# EAGLE schematic HSI-interface-2 (EAGLE 7.6.0)

## Sheet 1 of 7
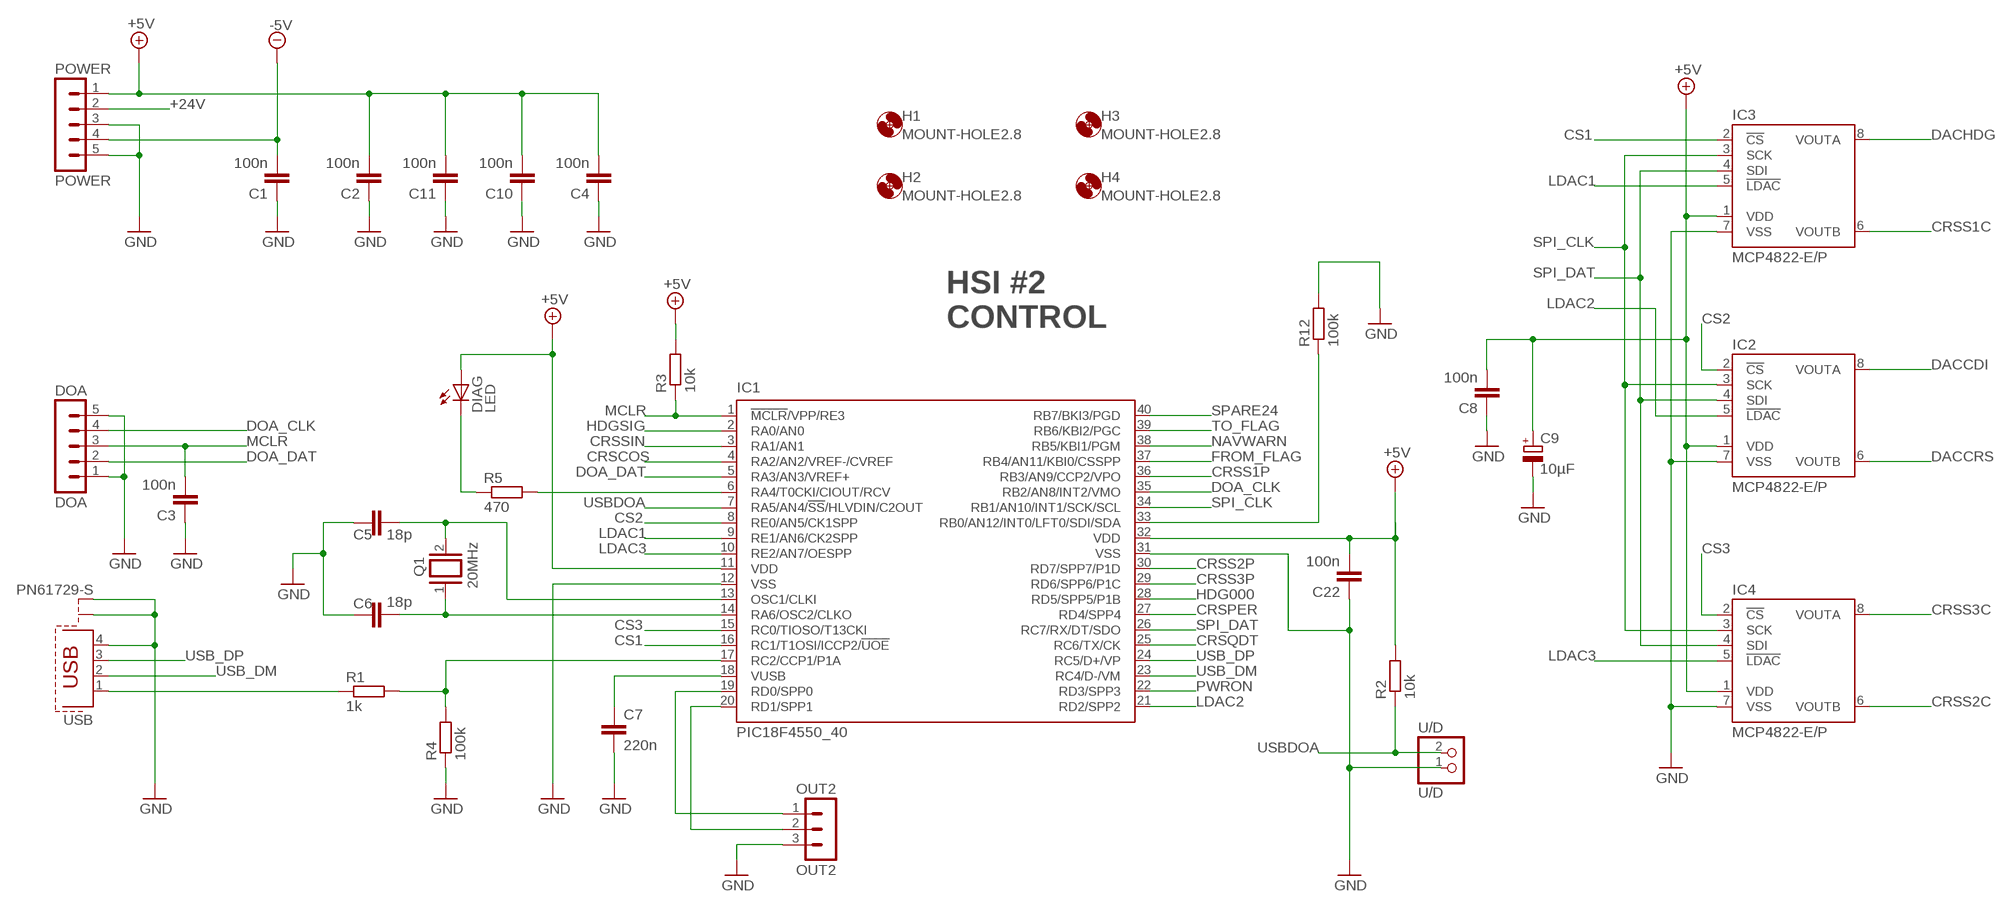
[diagram p0: schematic, sheet 1]

### Parts
C1  100n  C-EU025-025X050  [C025-025X050]
C2  100n  C-EU025-025X050  [C025-025X050]
C3  100n  C-EU025-025X050  [C025-025X050]
C4  100n  C-EU025-025X050  [C025-025X050]
C5  18p  C-EU025-025X050  [C025-025X050]
C6  18p  C-EU025-025X050  [C025-025X050]
C7  220n  C5/3  [C5B3]
C8  100n  C-EU025-025X050  [C025-025X050]
C9  10µF  CPOL-EUE2.5-5  [E2,5-5]
C10  100n  C-EU025-025X050  [C025-025X050]
C11  100n  C-EU025-025X050  [C025-025X050]
C22  100n  C-EU025-025X050  [C025-025X050]
DIAG  LED  LED3MM  [LED3MM]
DOA  DOA  MA05-1  [MA05-1]
H1  MOUNT-HOLE2.8  [2,8]
H2  MOUNT-HOLE2.8  [2,8]
H3  MOUNT-HOLE2.8  [2,8]
H4  MOUNT-HOLE2.8  [2,8]
IC1  PIC18F4550_40  [DIL40]
IC2  MCP4822-E/P  [DIL08]
IC3  MCP4822-E/P  [DIL08]
IC4  MCP4822-E/P  [DIL08]
OUT2  OUT2  MA03-1  [MA03-1]
POWER  POWER  MA05-1  [MA05-1]
Q1  20MHz  XTAL/S  [QS]
R1  1k  R-EU_0204/7  [0204/7]
R2  10k  R-EU_0204/7  [0204/7]
R3  10k  R-EU_0204/7  [0204/7]
R4  100k  R-EU_0204/7  [0204/7]
R5  470  R-EU_0204/7  [0204/7]
R12  100k  R-EU_0204/7  [0204/7]
U/D  U/D  PINHD-1X2  [1X02]
USB  PN61729-S  [PN61729-S]

### Nets
+5V [+5V]: C2.2 C4.2 C8.2 C9.+ C10.2 C11.2 C22.2 DIAG.A IC1.11(VDD) IC1.32(VDD) IC2.1(VDD) IC3.1(VDD) IC4.1(VDD) POWER.1 R2.2 R3.2 ; also sheet 2,3,4,5,6,7
+24V: POWER.2 ; also sheet 3
-5V [-5V]: C1.2 POWER.4 ; also sheet 2,4,5,6,7
CRSCOS: IC1.4(RA2/AN2/VREF-/CVREF) ; also sheet 6
CRSPER: IC1.27(RD4/SPP4) ; also sheet 2
CRSQDT: IC1.25(RC6/TX/CK) ; also sheet 2
CRSS1C: IC3.6(VOUTB) ; also sheet 7
CRSS1P: IC1.36(RB3/AN9/CCP2/VPO) ; also sheet 7
CRSS2C: IC4.6(VOUTB) ; also sheet 7
CRSS2P: IC1.30(RD7/SPP7/P1D) ; also sheet 7
CRSS3C: IC4.8(VOUTA) ; also sheet 7
CRSS3P: IC1.29(RD6/SPP6/P1C) ; also sheet 7
CRSSIN: IC1.3(RA1/AN1) ; also sheet 5
CS1: IC1.16(RC1/T1OSI/ICCP2/!UOE) IC3.2(!CS)
CS2: IC1.8(RE0/AN5/CK1SPP) IC2.2(!CS)
CS3: IC1.15(RC0/TIOSO/T13CKI) IC4.2(!CS)
DACCDI: IC2.8(VOUTA) ; also sheet 3
DACCRS: IC2.6(VOUTB) ; also sheet 3
DACHDG: IC3.8(VOUTA) ; also sheet 3
DOA_CLK: DOA.4 IC1.35(RB2/AN8/INT2/VMO)
DOA_DAT: DOA.2 IC1.5(RA3/AN3/VREF+)
FROM_FLAG: IC1.37(RB4/AN11/KBI0/CSSPP) ; also sheet 3
GND [ground]: C1.1 C2.1 C3.1 C4.1 C5.1 C6.1 C7.2 C8.1 C9.- C10.1 C11.1 C22.1 DOA.1 DOA.5 IC1.12(VSS) IC1.31(VSS) IC2.7(VSS) IC3.7(VSS) IC4.7(VSS) OUT2.3 POWER.3 POWER.5 R4.1 R12.2 U/D.1 USB.4 USB.S1 USB.S2 ; also sheet 2,3,4,5,6,7
HDG000: IC1.28(RD5/SPP5/P1B) ; also sheet 2
HDGSIG: IC1.2(RA0/AN0) ; also sheet 4
LDAC1: IC1.9(RE1/AN6/CK2SPP) IC3.5(!LDAC)
LDAC2: IC1.21(RD2/SPP2) IC2.5(!LDAC)
LDAC3: IC1.10(RE2/AN7/OESPP) IC4.5(!LDAC)
MCLR: C3.2 DOA.3 IC1.1(!MCLR!/VPP/RE3) R3.1
N$1: IC1.20(RD1/SPP1) OUT2.2
N$2: IC1.19(RD0/SPP0) OUT2.1
N$22: DIAG.K(C) R5.1
N$24: IC1.6(RA4/T0CKI/CIOUT/RCV) R5.2
N$58: R1.1 USB.1
N$60: IC1.17(RC2/CCP1/P1A) R1.2 R4.2
N$61: C6.2 IC1.14(RA6/OSC2/CLKO) Q1.1
N$84: C5.2 IC1.13(OSC1/CLKI) Q1.2
N$96: C7.1 IC1.18(VUSB)
N$122: IC1.33(RB0/AN12/INT0/LFT0/SDI/SDA) R12.1
NAVWARN: IC1.38(RB5/KBI1/PGM) ; also sheet 3
PWRON: IC1.22(RD3/SPP3) ; also sheet 2
SPARE24: IC1.40(RB7/BKI3/PGD) ; also sheet 3
SPI_CLK: IC1.34(RB1/AN10/INT1/SCK/SCL) IC2.3(SCK) IC3.3(SCK) IC4.3(SCK)
SPI_DAT: IC1.26(RC7/RX/DT/SDO) IC2.4(SDI) IC3.4(SDI) IC4.4(SDI)
TO_FLAG: IC1.39(RB6/KBI2/PGC) ; also sheet 3
USB_DM: IC1.23(RC4/D-/VM) USB.2
USB_DP: IC1.24(RC5/D+/VP) USB.3
USBDOA: IC1.7(RA5/AN4/!SS!/HLVDIN/C2OUT) R2.1 U/D.2

### Notes on the sheet
- HSI #2
  CONTROL

## Sheet 2 of 7
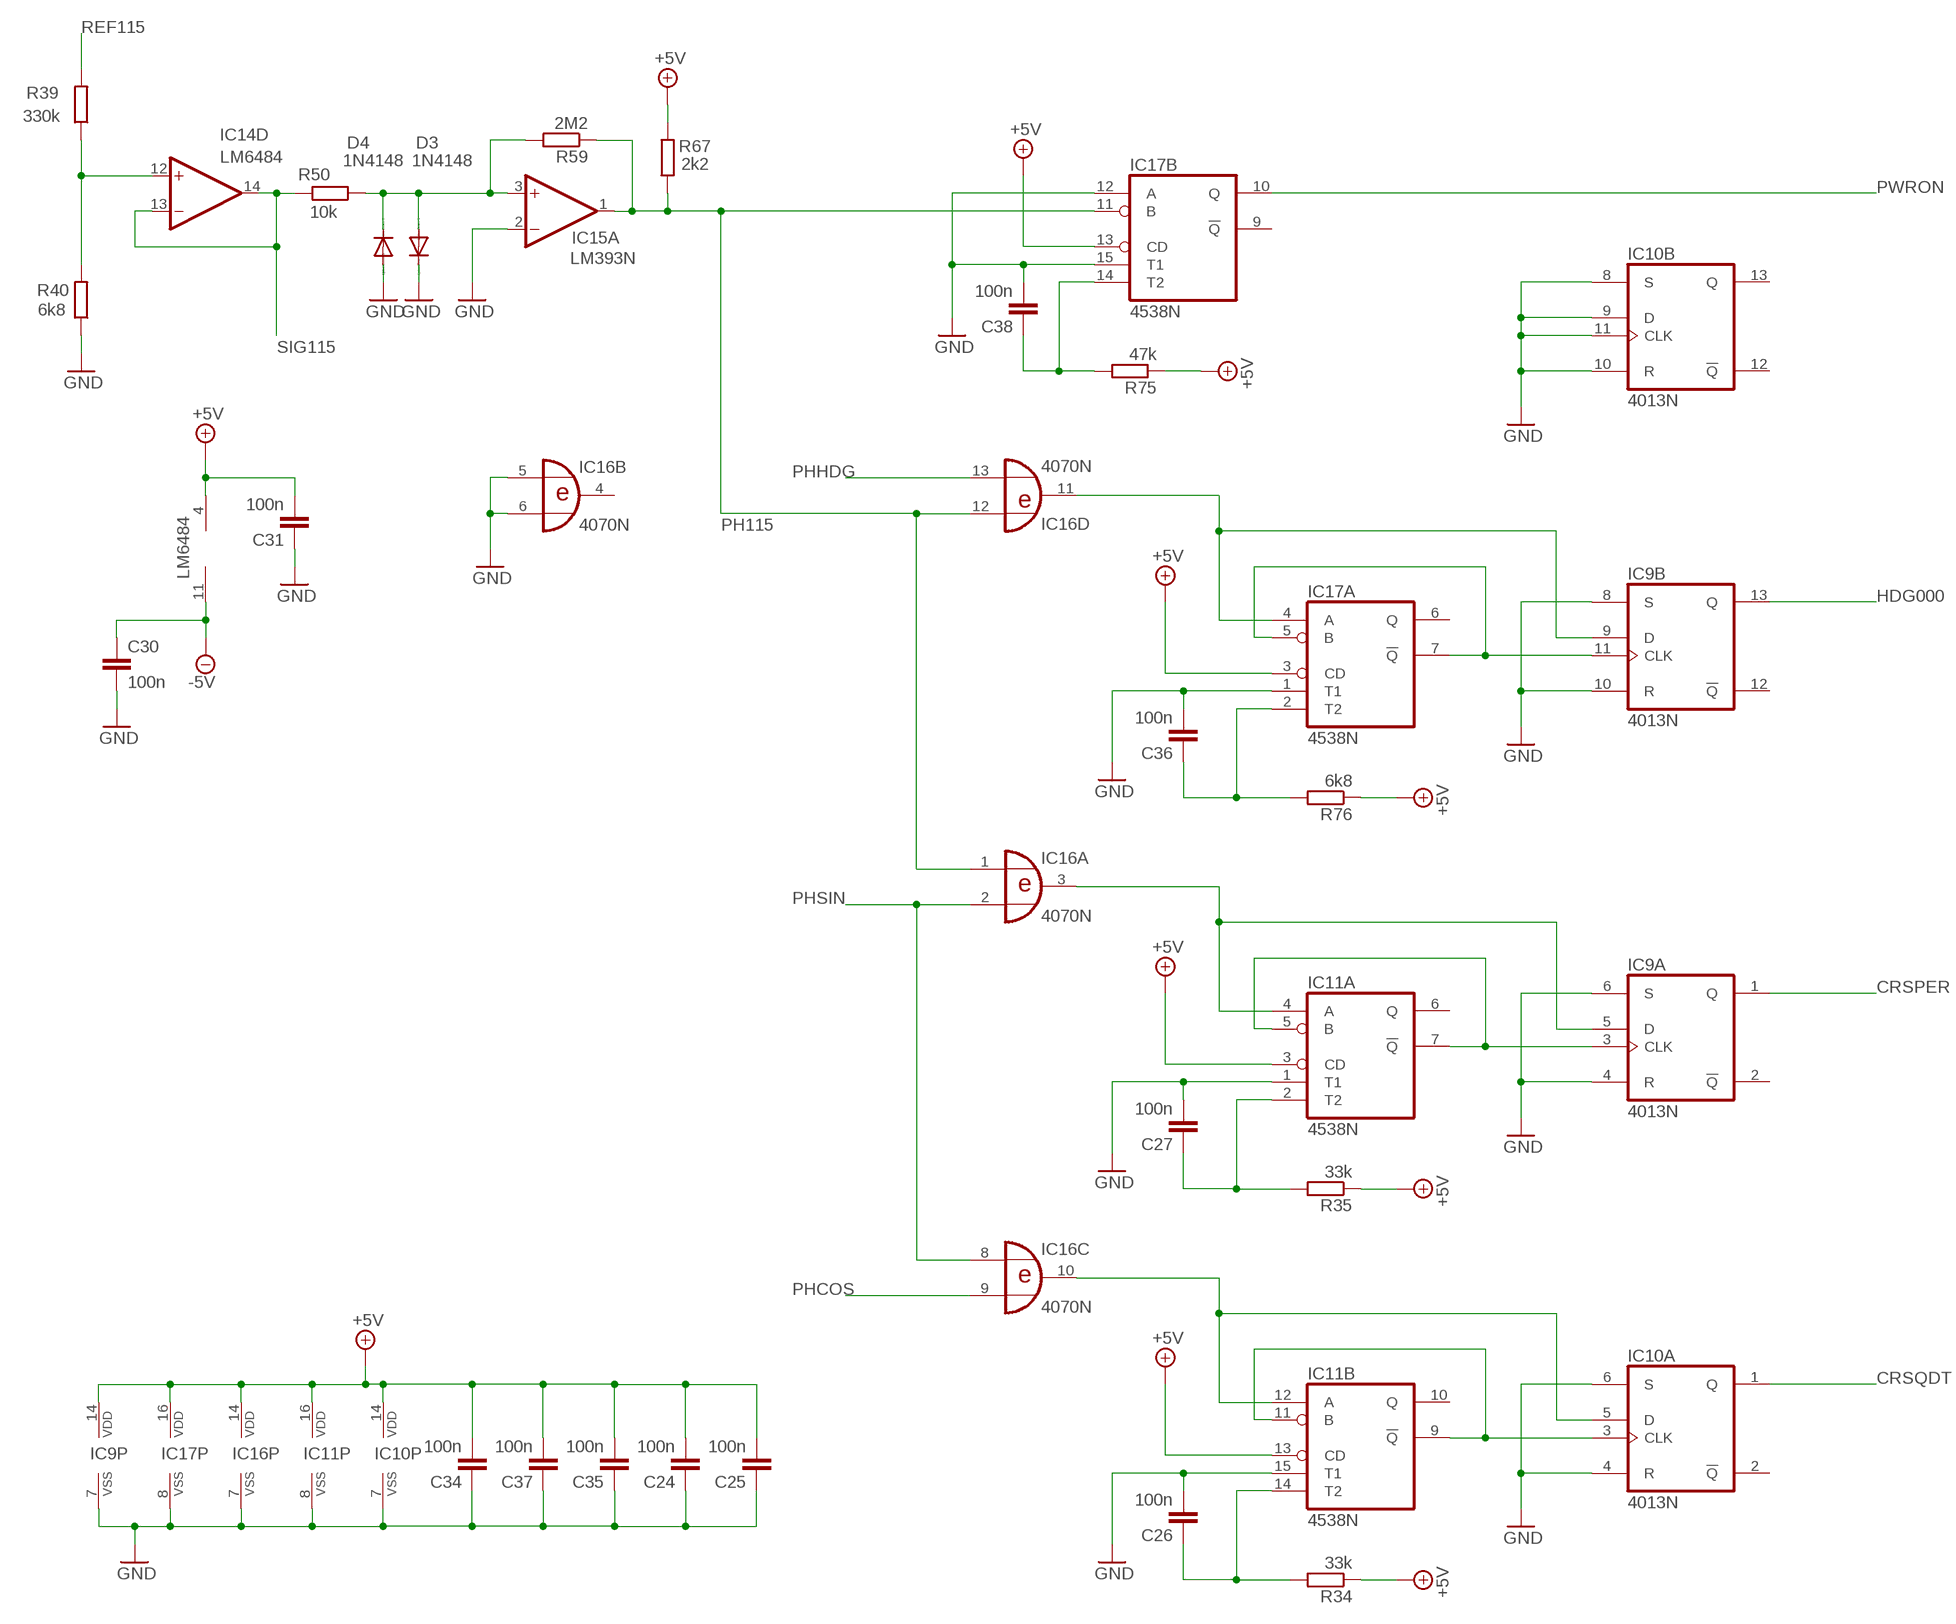
[diagram p1: schematic, sheet 2]

### Parts
C24  100n  C-EU025-025X050  [C025-025X050]
C25  100n  C-EU025-025X050  [C025-025X050]
C26  100n  C-EU025-025X050  [C025-025X050]
C27  100n  C-EU025-025X050  [C025-025X050]
C30  100n  C-EU025-025X050  [C025-025X050]
C31  100n  C-EU025-025X050  [C025-025X050]
C34  100n  C-EU025-025X050  [C025-025X050]
C35  100n  C-EU025-025X050  [C025-025X050]
C36  100n  C-EU025-025X050  [C025-025X050]
C37  100n  C-EU025-025X050  [C025-025X050]
C38  100n  C-EU025-025X050  [C025-025X050]
D3  1N4148  1N4148DO35-7  [DO35-7]
D4  1N4148  1N4148DO35-7  [DO35-7]
IC9  4013N  [DIL14]
IC10  4013N  [DIL14]
IC11  4538N  [DIL16]
IC14  LM6484  LM324N  [DIL14]
IC15  LM393N  [DIL08]
IC16  4070N  [DIL14]
IC17  4538N  [DIL16]
R34  33k  R-EU_0204/7  [0204/7]
R35  33k  R-EU_0204/7  [0204/7]
R39  330k  R-EU_0204/7  [0204/7]
R40  6k8  R-EU_0204/7  [0204/7]
R50  10k  R-EU_0204/7  [0204/7]
R59  2M2  R-EU_0204/7  [0204/7]
R67  2k2  R-EU_0204/7  [0204/7]
R75  47k  R-EU_0204/7  [0204/7]
R76  6k8  R-EU_0204/7  [0204/7]

### Nets
+5V [+5V]: C24.2 C25.2 C31.2 C34.2 C35.2 C37.2 IC9.14(P:VDD) IC10.14(P:VDD) IC11.3(A:CD) IC11.13(B:CD) IC11.16(P:VDD) IC14.4(P:V+) IC16.14(P:VDD) IC17.3(A:CD) IC17.13(B:CD) IC17.16(P:VDD) R34.1 R35.1 R67.2 R75.1 R76.1 ; also sheet 1,3,4,5,6,7
-5V [-5V]: C30.1 IC14.11(P:V-) ; also sheet 1,4,5,6,7
CRSPER: IC9.1(A:Q) ; also sheet 1
CRSQDT: IC10.1(A:Q) ; also sheet 1
GND [ground]: C24.1 C25.1 C26.2 C27.2 C30.2 C31.1 C34.1 C35.1 C36.2 C37.1 C38.2 D3.C D4.A IC9.4(A:R) IC9.6(A:S) IC9.7(P:VSS) IC9.8(B:S) IC9.10(B:R) IC10.4(A:R) IC10.6(A:S) IC10.7(P:VSS) IC10.8(B:S) IC10.9(B:D) IC10.10(B:R) IC10.11(B:CLK) IC11.1(A:T1) IC11.8(P:VSS) IC11.15(B:T1) IC15.2(A:-IN) IC16.5(B:I0) IC16.6(B:I1) IC16.7(P:VSS) IC17.1(A:T1) IC17.8(P:VSS) IC17.12(B:A) IC17.15(B:T1) R40.1 ; also sheet 1,3,4,5,6,7
HDG000: IC9.13(B:Q) ; also sheet 1
N$3: IC9.11(B:CLK) IC17.5(A:B) IC17.7(A:!Q)
N$7: IC14.12(D:+IN) R39.1 R40.2
N$29: IC9.9(B:D) IC16.11(D:O) IC17.4(A:A)
N$39: IC10.5(A:D) IC11.12(B:A) IC16.10(C:O)
N$53: IC9.5(A:D) IC11.4(A:A) IC16.3(A:O)
N$54: IC9.3(A:CLK) IC11.5(A:B) IC11.7(A:!Q)
N$55: D3.A D4.C IC15.3(A:+IN) R50.1 R59.2
N$57: C38.1 IC17.14(B:T2) R75.2
N$62: C36.1 IC17.2(A:T2) R76.2
N$65: IC10.3(A:CLK) IC11.9(B:!Q) IC11.11(B:B)
N$74: C27.1 IC11.2(A:T2) R35.2
N$75: C26.1 IC11.14(B:T2) R34.2
PH115: IC15.1(A:OUT) IC16.1(A:I0) IC16.12(D:I0) IC17.11(B:B) R59.1 R67.1
PHCOS: IC16.9(C:I1) ; also sheet 6
PHHDG: IC16.13(D:I1) ; also sheet 4
PHSIN: IC16.2(A:I1) IC16.8(C:I0) ; also sheet 5
PWRON: IC17.10(B:Q) ; also sheet 1
REF115: R39.2 ; also sheet 4
SIG115: IC14.13(D:-IN) IC14.14(D:OUT) R50.2 ; also sheet 7
Unconnected: IC9.2(A:!Q) IC9.12(B:!Q) IC10.2(A:!Q) IC10.12(B:!Q) IC10.13(B:Q) IC11.6(A:Q) IC11.10(B:Q) IC16.4(B:O) IC17.6(A:Q) IC17.9(B:!Q)

### Notes on the sheet
- LM6484

## Sheet 3 of 7
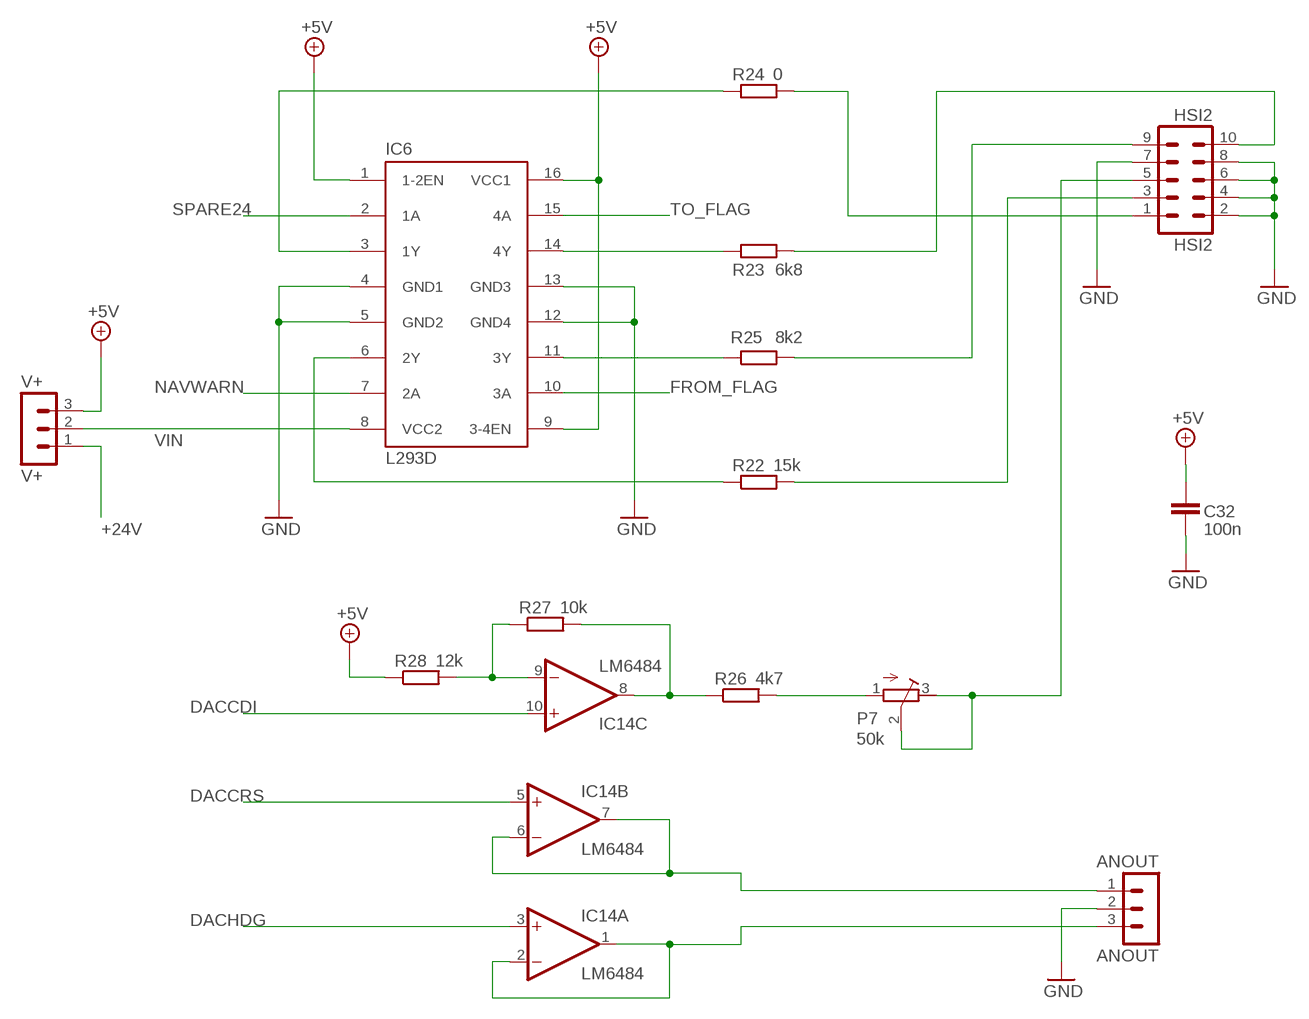
[diagram p2: schematic, sheet 3]

### Parts
ANOUT  ANOUT  MA03-1  [MA03-1]
C32  100n  C-EU025-025X050  [C025-025X050]
HSI2  HSI2  MA05-2  [MA05-2]
IC6  L293D  [DIL16]
P7  50k  R-TRIMM64Z  [RTRIM64Z]
R22  15k  R-EU_0204/7  [0204/7]
R23  6k8  R-EU_0204/7  [0204/7]
R24  0  R-EU_0204/7  [0204/7]
R25  8k2  R-EU_0204/7  [0204/7]
R26  4k7  R-EU_0204/7  [0204/7]
R27  10k  R-EU_0204/7  [0204/7]
R28  12k  R-EU_0204/7  [0204/7]
V+  V+  MA03-1  [MA03-1]

### Nets
+5V [+5V]: C32.2 IC6.1(1-2EN) IC6.9(3-4EN) IC6.16(VCC1) R28.1 V+.3 ; also sheet 1,2,4,5,6,7
+24V: V+.1 ; also sheet 1
DACCDI: IC14.10(C:+IN) ; also sheet 1
DACCRS: IC14.5(B:+IN) ; also sheet 1
DACHDG: IC14.3(A:+IN) ; also sheet 1
FROM_FLAG: IC6.10(3A) ; also sheet 1
GND [ground]: ANOUT.2 C32.1 HSI2.2 HSI2.4 HSI2.6 HSI2.7 HSI2.8 IC6.4(GND1) IC6.5(GND2) IC6.12(GND4) IC6.13(GND3) ; also sheet 1,2,4,5,6,7
N$8: HSI2.3 R22.2
N$9: HSI2.1 R24.2
N$10: IC14.8(C:OUT) R26.1 R27.2
N$11: HSI2.5 P7.2(S) P7.3(A)
N$12: ANOUT.1 IC14.6(B:-IN) IC14.7(B:OUT)
N$25: HSI2.10 R23.2
N$27: IC6.14(4Y) R23.1
N$28: HSI2.9 R25.2
N$34: IC6.6(2Y) R22.1
N$35: IC14.9(C:-IN) R27.1 R28.2
N$36: IC6.3(1Y) R24.1
N$64: P7.1(E) R26.2
N$80: ANOUT.3 IC14.1(A:OUT) IC14.2(A:-IN)
N$121: IC6.11(3Y) R25.1
NAVWARN: IC6.7(2A) ; also sheet 1
SPARE24: IC6.2(1A) ; also sheet 1
TO_FLAG: IC6.15(4A) ; also sheet 1
VIN: IC6.8(VCC2) V+.2

## Sheet 4 of 7
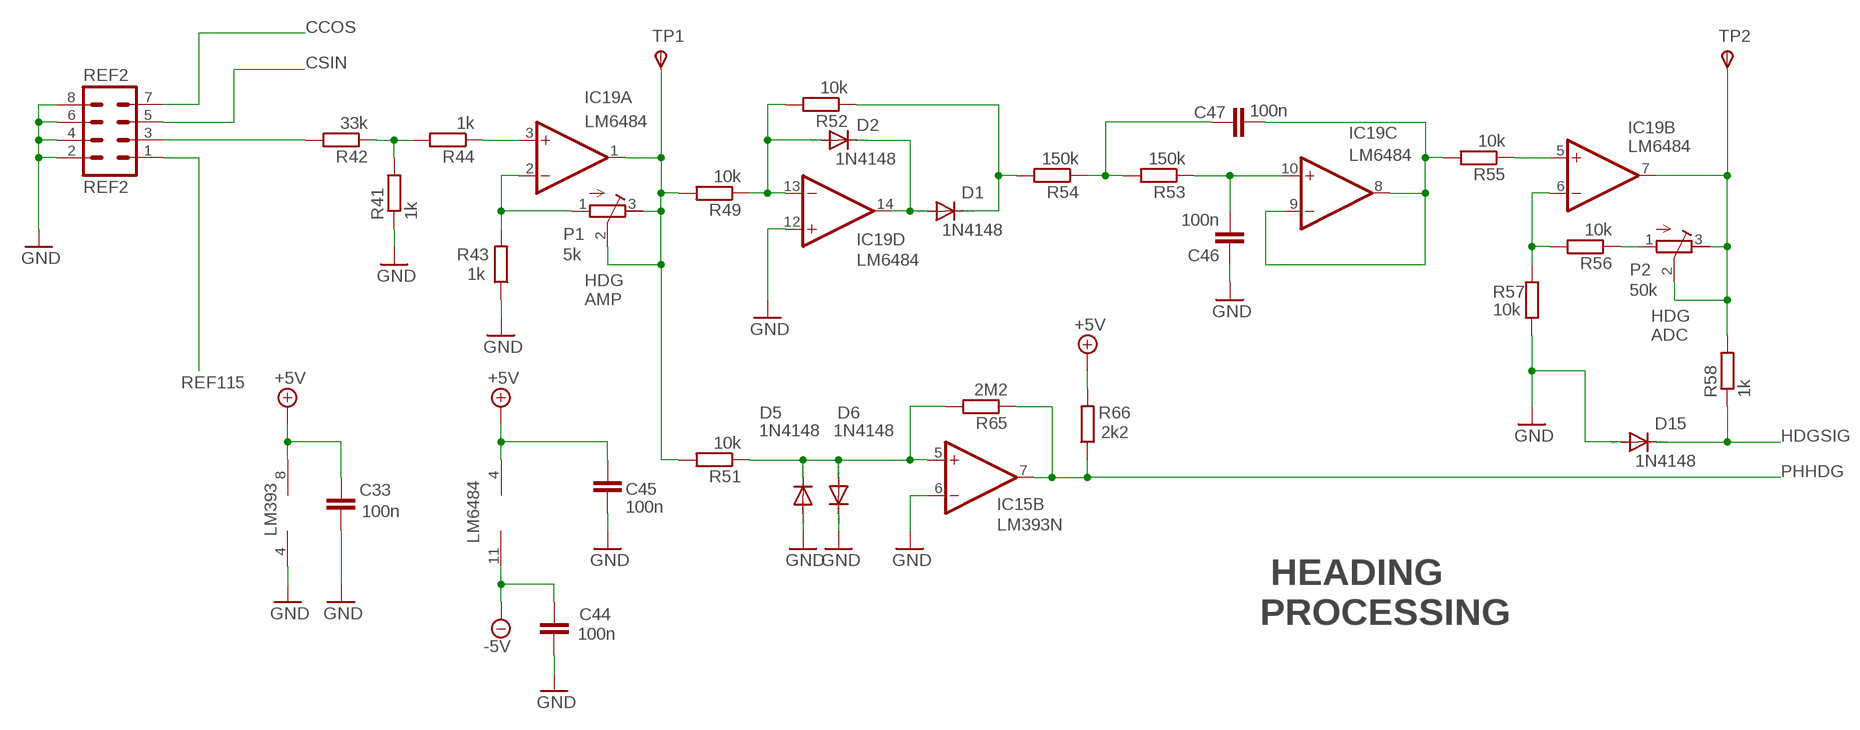
[diagram p3: schematic, sheet 4]

### Parts
C33  100n  C-EU025-025X050  [C025-025X050]
C44  100n  C-EU025-025X050  [C025-025X050]
C45  100n  C-EU025-025X050  [C025-025X050]
C46  100n  C-EU025-025X050  [C025-025X050]
C47  100n  C-EU025-025X050  [C025-025X050]
D1  1N4148  1N4148DO35-7  [DO35-7]
D2  1N4148  1N4148DO35-7  [DO35-7]
D5  1N4148  1N4148DO35-7  [DO35-7]
D6  1N4148  1N4148DO35-7  [DO35-7]
D15  1N4148  1N4148DO35-7  [DO35-7]
IC19  LM6484  LM324N  [DIL14]
P1  5k  R-TRIMM64Z  [RTRIM64Z]
P2  50k  R-TRIMM64Z  [RTRIM64Z]
R41  1k  R-EU_0204/7  [0204/7]
R42  33k  R-EU_0204/7  [0204/7]
R43  1k  R-EU_0204/7  [0204/7]
R44  1k  R-EU_0204/7  [0204/7]
R49  10k  R-EU_0204/7  [0204/7]
R51  10k  R-EU_0204/7  [0204/7]
R52  10k  R-EU_0204/7  [0204/7]
R53  150k  R-EU_0204/7  [0204/7]
R54  150k  R-EU_0204/7  [0204/7]
R55  10k  R-EU_0204/7  [0204/7]
R56  10k  R-EU_0204/7  [0204/7]
R57  10k  R-EU_0204/7  [0204/7]
R58  1k  R-EU_0204/7  [0204/7]
R65  2M2  R-EU_0204/7  [0204/7]
R66  2k2  R-EU_0204/7  [0204/7]
REF2  REF2  MA04-2  [MA04-2]
TP1  TPSPAD1-13  [P1-13]
TP2  TPSPAD1-13  [P1-13]

### Nets
+5V [+5V]: C33.2 C45.2 IC15.8(P:V+) IC19.4(P:V+) R66.2 ; also sheet 1,2,3,5,6,7
-5V [-5V]: C44.2 IC19.11(P:V-) ; also sheet 1,2,5,6,7
CCOS: REF2.7 ; also sheet 6
CSIN: REF2.5 ; also sheet 5
GND [ground]: C33.1 C44.1 C45.1 C46.1 D5.A D6.C D15.A IC15.4(P:V-) IC15.6(B:-IN) IC19.12(D:+IN) R41.1 R43.1 R57.2 REF2.2 REF2.4 REF2.6 REF2.8 ; also sheet 1,2,3,5,6,7
HDGSIG: D15.C R58.1 ; also sheet 1
N$4: IC19.3(A:+IN) R44.1
N$5: R42.2 REF2.3
N$38: R41.2 R42.1 R44.2
N$40: IC19.2(A:-IN) P1.1(E) R43.2
N$41: IC19.1(A:OUT) P1.2(S) P1.3(A) R49.2 R51.2 TP1.TP(PP)
N$42: D1.A D2.C IC19.14(D:OUT)
N$43: D2.A IC19.13(D:-IN) R49.1 R52.2
N$44: D1.C R52.1 R54.2
N$45: C47.1 R53.2 R54.1
N$46: C46.2 IC19.10(C:+IN) R53.1
N$47: C47.2 IC19.8(C:OUT) IC19.9(C:-IN) R55.2
N$48: IC19.5(B:+IN) R55.1
N$49: IC19.6(B:-IN) R56.2 R57.1
N$50: P2.1(E) R56.1
N$52: D5.C D6.A IC15.5(B:+IN) R51.1 R65.2
N$76: IC19.7(B:OUT) P2.2(S) P2.3(A) R58.2 TP2.TP(PP)
PHHDG: IC15.7(B:OUT) R65.1 R66.1 ; also sheet 2
REF115: REF2.1 ; also sheet 2

### Notes on the sheet
- HDG
  AMP
- HDG
  ADC
- LM393
- LM6484
- HEADING
  PROCESSING

## Sheet 5 of 7
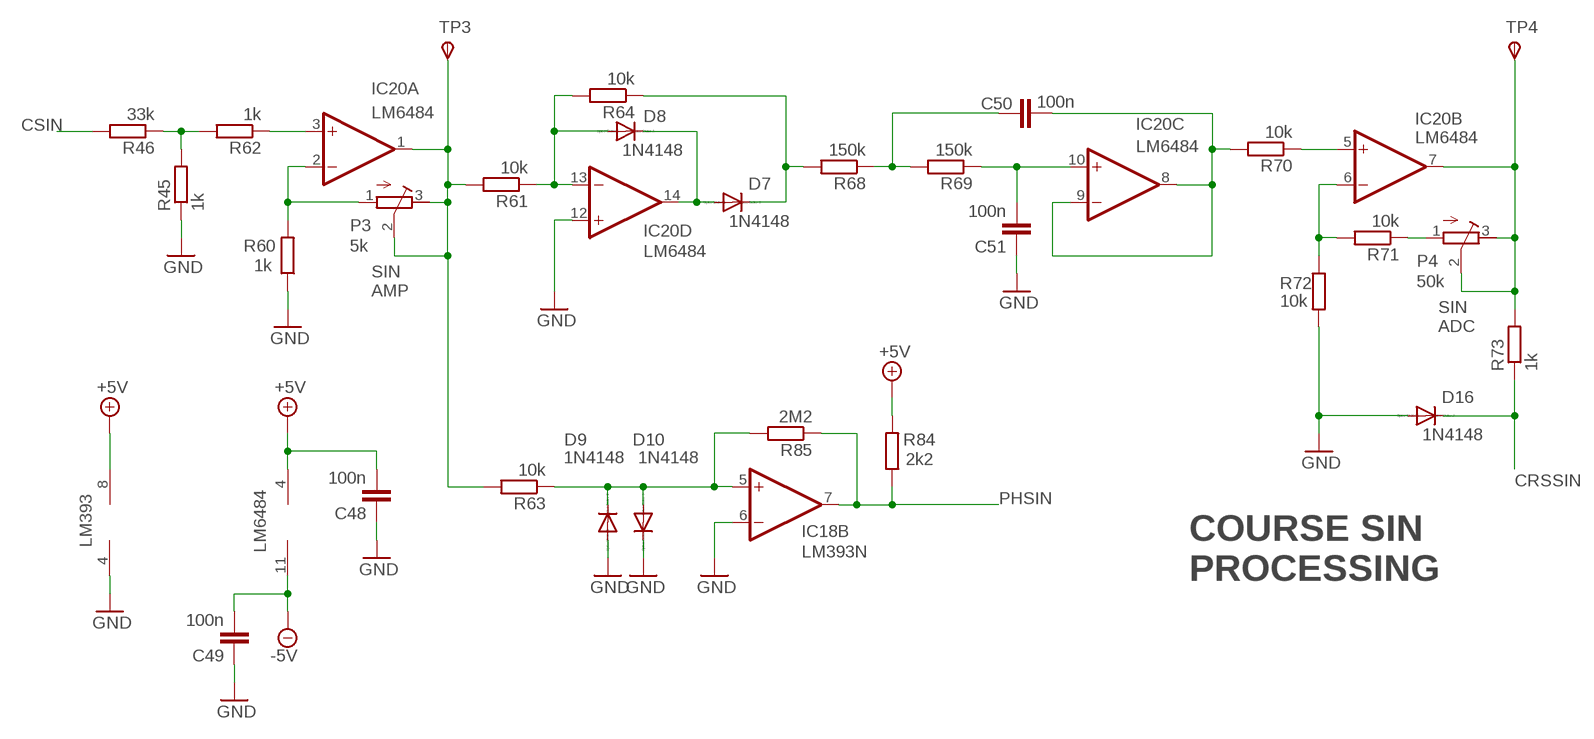
[diagram p4: schematic, sheet 5]

### Parts
C48  100n  C-EU025-025X050  [C025-025X050]
C49  100n  C-EU025-025X050  [C025-025X050]
C50  100n  C-EU025-025X050  [C025-025X050]
C51  100n  C-EU025-025X050  [C025-025X050]
D7  1N4148  1N4148DO35-7  [DO35-7]
D8  1N4148  1N4148DO35-7  [DO35-7]
D9  1N4148  1N4148DO35-7  [DO35-7]
D10  1N4148  1N4148DO35-7  [DO35-7]
D16  1N4148  1N4148DO35-7  [DO35-7]
IC18  LM393N  [DIL08]
IC20  LM6484  LM324N  [DIL14]
P3  5k  R-TRIMM64Z  [RTRIM64Z]
P4  50k  R-TRIMM64Z  [RTRIM64Z]
R45  1k  R-EU_0204/7  [0204/7]
R46  33k  R-EU_0204/7  [0204/7]
R60  1k  R-EU_0204/7  [0204/7]
R61  10k  R-EU_0204/7  [0204/7]
R62  1k  R-EU_0204/7  [0204/7]
R63  10k  R-EU_0204/7  [0204/7]
R64  10k  R-EU_0204/7  [0204/7]
R68  150k  R-EU_0204/7  [0204/7]
R69  150k  R-EU_0204/7  [0204/7]
R70  10k  R-EU_0204/7  [0204/7]
R71  10k  R-EU_0204/7  [0204/7]
R72  10k  R-EU_0204/7  [0204/7]
R73  1k  R-EU_0204/7  [0204/7]
R84  2k2  R-EU_0204/7  [0204/7]
R85  2M2  R-EU_0204/7  [0204/7]
TP3  TPSPAD1-13  [P1-13]
TP4  TPSPAD1-13  [P1-13]

### Nets
+5V [+5V]: C48.2 IC18.8(P:V+) IC20.4(P:V+) R84.2 ; also sheet 1,2,3,4,6,7
-5V [-5V]: C49.2 IC20.11(P:V-) ; also sheet 1,2,4,6,7
CRSSIN: D16.C R73.1 ; also sheet 1
CSIN: R46.2 ; also sheet 4
GND [ground]: C48.1 C49.1 C51.1 D9.A D10.C D16.A IC18.4(P:V-) IC18.6(B:-IN) IC20.12(D:+IN) R45.1 R60.1 R72.2 ; also sheet 1,2,3,4,6,7
N$13: R45.2 R46.1 R62.2
N$14: IC20.2(A:-IN) P3.1(E) R60.2
N$15: IC20.1(A:OUT) P3.2(S) P3.3(A) R61.2 R63.2 TP3.TP(PP)
N$16: D7.A D8.C IC20.14(D:OUT)
N$17: D8.A IC20.13(D:-IN) R61.1 R64.2
N$18: D7.C R64.1 R68.2
N$19: C50.1 R68.1 R69.2
N$20: C51.2 IC20.10(C:+IN) R69.1
N$21: C50.2 IC20.8(C:OUT) IC20.9(C:-IN) R70.2
N$23: IC20.5(B:+IN) R70.1
N$26: IC20.6(B:-IN) R71.2 R72.1
N$30: P4.1(E) R71.1
N$32: IC20.3(A:+IN) R62.1
N$37: D9.C D10.A IC18.5(B:+IN) R63.1 R85.2
N$120: IC20.7(B:OUT) P4.2(S) P4.3(A) R73.2 TP4.TP(PP)
PHSIN: IC18.7(B:OUT) R84.1 R85.1 ; also sheet 2

### Notes on the sheet
- SIN
  AMP
- SIN
  ADC
- LM393
- LM6484
- COURSE SIN
  PROCESSING

## Sheet 6 of 7
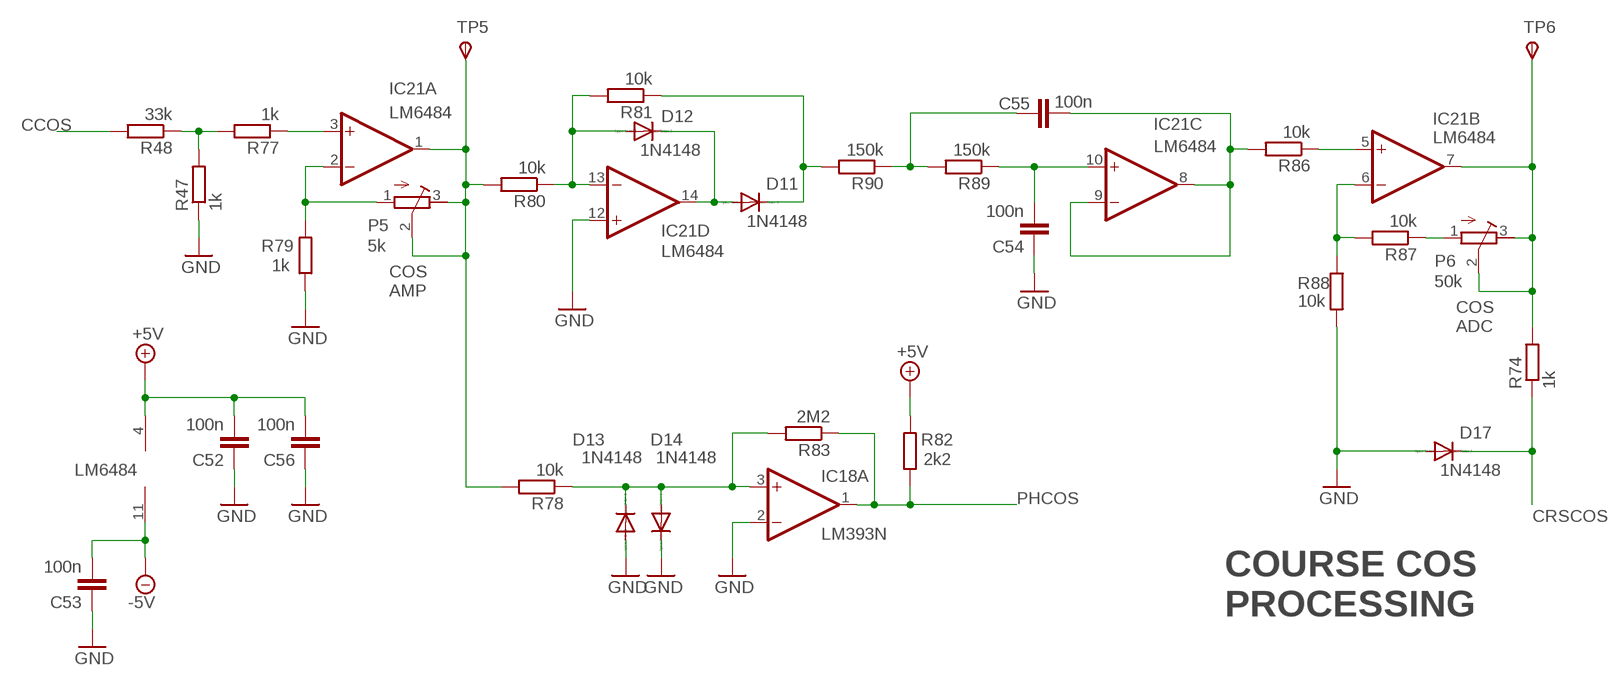
[diagram p5: schematic, sheet 6]

### Parts
C52  100n  C-EU025-025X050  [C025-025X050]
C53  100n  C-EU025-025X050  [C025-025X050]
C54  100n  C-EU025-025X050  [C025-025X050]
C55  100n  C-EU025-025X050  [C025-025X050]
C56  100n  C-EU025-025X050  [C025-025X050]
D11  1N4148  1N4148DO35-7  [DO35-7]
D12  1N4148  1N4148DO35-7  [DO35-7]
D13  1N4148  1N4148DO35-7  [DO35-7]
D14  1N4148  1N4148DO35-7  [DO35-7]
D17  1N4148  1N4148DO35-7  [DO35-7]
IC21  LM6484  LM324N  [DIL14]
P5  5k  R-TRIMM64Z  [RTRIM64Z]
P6  50k  R-TRIMM64Z  [RTRIM64Z]
R47  1k  R-EU_0204/7  [0204/7]
R48  33k  R-EU_0204/7  [0204/7]
R74  1k  R-EU_0204/7  [0204/7]
R77  1k  R-EU_0204/7  [0204/7]
R78  10k  R-EU_0204/7  [0204/7]
R79  1k  R-EU_0204/7  [0204/7]
R80  10k  R-EU_0204/7  [0204/7]
R81  10k  R-EU_0204/7  [0204/7]
R82  2k2  R-EU_0204/7  [0204/7]
R83  2M2  R-EU_0204/7  [0204/7]
R86  10k  R-EU_0204/7  [0204/7]
R87  10k  R-EU_0204/7  [0204/7]
R88  10k  R-EU_0204/7  [0204/7]
R89  150k  R-EU_0204/7  [0204/7]
R90  150k  R-EU_0204/7  [0204/7]
TP5  TPSPAD1-13  [P1-13]
TP6  TPSPAD1-13  [P1-13]

### Nets
+5V [+5V]: C52.2 C56.2 IC21.4(P:V+) R82.2 ; also sheet 1,2,3,4,5,7
-5V [-5V]: C53.2 IC21.11(P:V-) ; also sheet 1,2,4,5,7
CCOS: R48.2 ; also sheet 4
CRSCOS: D17.C R74.1 ; also sheet 1
GND [ground]: C52.1 C53.1 C54.1 C56.1 D13.A D14.C D17.A IC18.2(A:-IN) IC21.12(D:+IN) R47.1 R79.1 R88.2 ; also sheet 1,2,3,4,5,7
N$31: R47.2 R48.1 R77.2
N$33: IC21.2(A:-IN) P5.1(E) R79.2
N$51: IC21.1(A:OUT) P5.2(S) P5.3(A) R78.2 R80.2 TP5.TP(PP)
N$56: D11.A D12.C IC21.14(D:OUT)
N$59: D12.A IC21.13(D:-IN) R80.1 R81.2
N$63: D11.C R81.1 R90.2
N$66: C55.1 R89.2 R90.1
N$67: C54.2 IC21.10(C:+IN) R89.1
N$68: C55.2 IC21.8(C:OUT) IC21.9(C:-IN) R86.2
N$69: IC21.5(B:+IN) R86.1
N$70: IC21.6(B:-IN) R87.2 R88.1
N$71: P6.1(E) R87.1
N$72: IC21.3(A:+IN) R77.1
N$73: D13.C D14.A IC18.3(A:+IN) R78.1 R83.2
N$119: IC21.7(B:OUT) P6.2(S) P6.3(A) R74.2 TP6.TP(PP)
PHCOS: IC18.1(A:OUT) R82.1 R83.1 ; also sheet 2

### Notes on the sheet
- COS
  AMP
- COS
  ADC
- LM6484
- COURSE COS
  PROCESSING

## Sheet 7 of 7
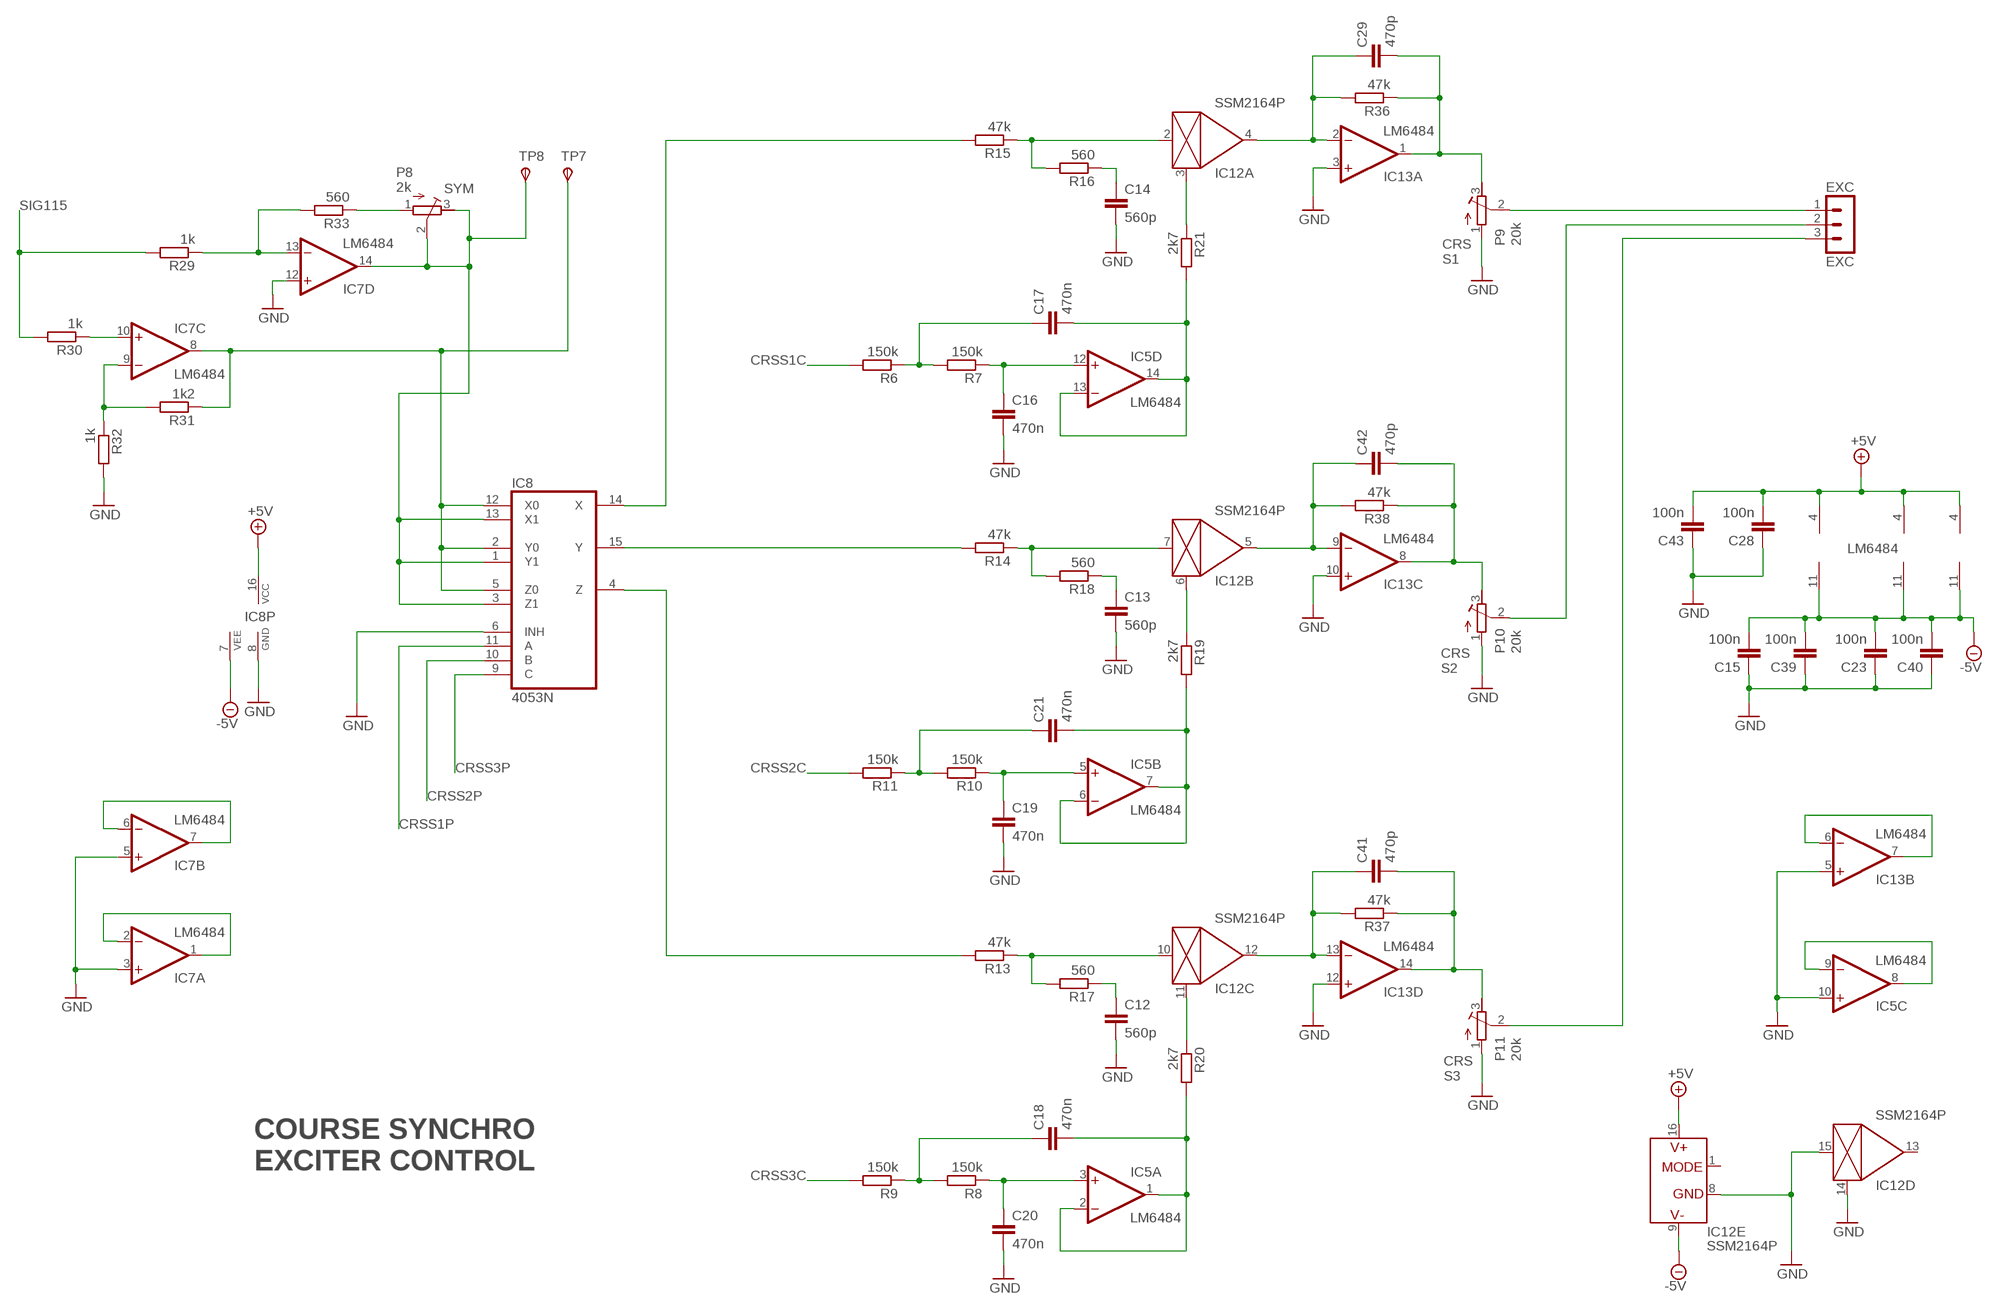
[diagram p6: schematic, sheet 7]

### Parts
C12  560p  C-EU025-025X050  [C025-025X050]
C13  560p  C-EU025-025X050  [C025-025X050]
C14  560p  C-EU025-025X050  [C025-025X050]
C15  100n  C-EU025-025X050  [C025-025X050]
C16  470n  C-EU025-025X050  [C025-025X050]
C17  470n  C-EU025-025X050  [C025-025X050]
C18  470n  C-EU025-025X050  [C025-025X050]
C19  470n  C-EU025-025X050  [C025-025X050]
C20  470n  C-EU025-025X050  [C025-025X050]
C21  470n  C-EU025-025X050  [C025-025X050]
C23  100n  C-EU025-025X050  [C025-025X050]
C28  100n  C-EU025-025X050  [C025-025X050]
C29  470p  C-EU025-025X050  [C025-025X050]
C39  100n  C-EU025-025X050  [C025-025X050]
C40  100n  C-EU025-025X050  [C025-025X050]
C41  470p  C-EU025-025X050  [C025-025X050]
C42  470p  C-EU025-025X050  [C025-025X050]
C43  100n  C-EU025-025X050  [C025-025X050]
EXC  EXC  MA03-1  [MA03-1]
IC5  LM6484  LM324N  [DIL14]
IC7  LM6484  LM324N  [DIL14]
IC8  4053N  [DIL16]
IC12  SSM2164P  [DIL16]
IC13  LM6484  LM324N  [DIL14]
P8  2k  R-TRIMM64Z  [RTRIM64Z]
P9  20k  R-TRIMM64Z  [RTRIM64Z]
P10  20k  R-TRIMM64Z  [RTRIM64Z]
P11  20k  R-TRIMM64Z  [RTRIM64Z]
R6  150k  R-EU_0204/7  [0204/7]
R7  150k  R-EU_0204/7  [0204/7]
R8  150k  R-EU_0204/7  [0204/7]
R9  150k  R-EU_0204/7  [0204/7]
R10  150k  R-EU_0204/7  [0204/7]
R11  150k  R-EU_0204/7  [0204/7]
R13  47k  R-EU_0204/7  [0204/7]
R14  47k  R-EU_0204/7  [0204/7]
R15  47k  R-EU_0204/7  [0204/7]
R16  560  R-EU_0204/7  [0204/7]
R17  560  R-EU_0204/7  [0204/7]
R18  560  R-EU_0204/7  [0204/7]
R19  2k7  R-EU_0204/7  [0204/7]
R20  2k7  R-EU_0204/7  [0204/7]
R21  2k7  R-EU_0204/7  [0204/7]
R29  1k  R-EU_0204/7  [0204/7]
R30  1k  R-EU_0204/7  [0204/7]
R31  1k2  R-EU_0204/7  [0204/7]
R32  1k  R-EU_0204/7  [0204/7]
R33  560  R-EU_0204/7  [0204/7]
R36  47k  R-EU_0204/7  [0204/7]
R37  47k  R-EU_0204/7  [0204/7]
R38  47k  R-EU_0204/7  [0204/7]
TP7  TPSPAD1-13  [P1-13]
TP8  TPSPAD1-13  [P1-13]

### Nets
+5V [+5V]: C28.2 C43.2 IC5.4(P:V+) IC7.4(P:V+) IC8.16(VCC) IC12.16(E:V+) IC13.4(P:V+) ; also sheet 1,2,3,4,5,6
-5V [-5V]: C15.2 C23.2 C39.2 C40.2 IC5.11(P:V-) IC7.11(P:V-) IC8.7(VEE) IC12.9(E:V-) IC13.11(P:V-) ; also sheet 1,2,4,5,6
CRSS1C: R6.2 ; also sheet 1
CRSS1P: IC8.11(A) ; also sheet 1
CRSS2C: R11.2 ; also sheet 1
CRSS2P: IC8.10(B) ; also sheet 1
CRSS3C: R9.2 ; also sheet 1
CRSS3P: IC8.9(C) ; also sheet 1
GND [ground]: C12.2 C13.2 C14.2 C15.1 C16.2 C19.2 C20.2 C23.1 C28.1 C39.1 C40.1 C43.1 IC5.10(C:+IN) IC7.3(A:+IN) IC7.5(B:+IN) IC7.12(D:+IN) IC8.6(INH) IC8.8(GND) IC12.8(E:GND) IC12.14(D:CTRL) IC12.15(D:IN) IC13.3(A:+IN) IC13.5(B:+IN) IC13.10(C:+IN) IC13.12(D:+IN) P9.1(E) P10.1(E) P11.1(E) R32.2 ; also sheet 1,2,3,4,5,6
N$6: P8.1(E) R33.1
N$77: IC12.2(A:IN) R15.1 R16.2
N$78: C14.1 R16.1
N$79: C29.1 IC12.4(A:OUT) IC13.2(A:-IN) R36.2
N$81: C29.2 IC13.1(A:OUT) P9.3(A) R36.1
N$82: C17.2 IC5.13(D:-IN) IC5.14(D:OUT) R21.2
N$83: IC12.3(A:CTRL) R21.1
N$85: C16.1 IC5.12(D:+IN) R7.1
N$86: C17.1 R6.1 R7.2
N$87: C42.1 IC12.5(B:OUT) IC13.9(C:-IN) R38.2
N$88: C42.2 IC13.8(C:OUT) P10.3(A) R38.1
N$89: IC12.6(B:CTRL) R19.1
N$90: IC12.7(B:IN) R14.1 R18.2
N$91: C13.1 R18.1
N$92: C21.2 IC5.6(B:-IN) IC5.7(B:OUT) R19.2
N$93: C21.1 R10.2 R11.1
N$94: C19.1 IC5.5(B:+IN) R10.1
N$95: C41.1 IC12.12(C:OUT) IC13.13(D:-IN) R37.2
N$97: C41.2 IC13.14(D:OUT) P11.3(A) R37.1
N$98: IC12.10(C:IN) R13.1 R17.2
N$99: IC12.11(C:CTRL) R20.1
N$100: C12.1 R17.1
N$101: C18.2 IC5.1(A:OUT) IC5.2(A:-IN) R20.2
N$102: C18.1 R8.2 R9.1
N$103: C20.1 IC5.3(A:+IN) R8.1
N$104: IC8.15(Y) R14.2
N$105: IC8.14(X) R15.2
N$106: IC8.4(Z) R13.2
N$107: IC7.1(A:OUT) IC7.2(A:-IN)
N$108: IC7.13(D:-IN) R29.1 R33.2
N$109: IC7.9(C:-IN) R31.2 R32.1
N$110: IC7.8(C:OUT) IC8.2(Y0) IC8.5(Z0) IC8.12(X0) R31.1 TP7.TP(PP)
N$111: IC7.14(D:OUT) IC8.1(Y1) IC8.3(Z1) IC8.13(X1) P8.2(S) P8.3(A) TP8.TP(PP)
N$112: IC7.6(B:-IN) IC7.7(B:OUT)
N$113: IC7.10(C:+IN) R30.1
N$114: IC13.6(B:-IN) IC13.7(B:OUT)
N$115: IC5.8(C:OUT) IC5.9(C:-IN)
N$116: EXC.1 P9.2(S)
N$117: EXC.2 P10.2(S)
N$118: EXC.3 P11.2(S)
SIG115: R29.2 R30.2 ; also sheet 2
Unconnected: IC12.1(E:MODE) IC12.13(D:OUT)

### Notes on the sheet
- SYM
- CRS
  S1
- LM6484
- CRS
  S2
- CRS
  S3
- COURSE SYNCHRO
  EXCITER CONTROL

## Library data of the parts
ANOUT EXC OUT2 V+ = con-lstb:MA03-1: PIN HEADER; OC_FARNELL: unknown; OC_NEWARK: unknown
C1-C6 C8 C10-C56 = rcl:C-EU: CAPACITOR, European symbol
C7 = capacitor-wima:C: CAPACITOR naming: grid - package width
C9 = rcl:CPOL-EU: POLARIZED CAPACITOR, European symbol
D1-D17 = diode:1N4148: DIODE high speed (Philips)
DIAG = henk:LED: LEDs Standard schematic elements and footprints for 5mm, 3mm, 1206, and 0603 sized LEDs. 5mm - Spark Fun Electronics SKU : COM-00529 (and others)
DOA POWER = con-lstb:MA05-1: PIN HEADER; OC_FARNELL: unknown; OC_NEWARK: unknown
H1-H4 = holes:MOUNT-HOLE: MOUNTING HOLE with drill center marker
HSI2 = con-lstb:MA05-2: PIN HEADER; OC_FARNELL: unknown; OC_NEWARK: unknown
IC1 = microchip:PIC18F4*_40: USB Microcontrollers with nanoWatt Technology High-Performance, Enhanced Flash, 28/40/44-Pin, Source: http://ww1.microchip.com/downloads/en/devicedoc/39632c.pdf; MF: MICROCHIP; MPN: PIC18F4550-I/P; OC_FARNELL: 9321357; OC_NEWARK: 74K8623
IC2-IC4 = nh-ic:MCP4822: Microchip MCP4822 According to datasheet http://ww1.microchip.com/downloads/en/DeviceDoc/22249A.pdf. Created by Nils Hintze <n.hintze@elektronikpage.net>
IC5 IC7 IC13 IC14 IC19-IC21 = linear:LM324: OP AMP
IC6 = st-microelectronics:L293D: PUSH-PULL 4 CHANNEL DRIVER; MPN: L293D; OC_FARNELL: 9589619; OC_NEWARK: 56P8249
IC8 = 40xx:4053: Triple 2-channel ANALOG MULTIPLEXER
IC9 IC10 = 40xx:4013: Dual D FLIP FLOP, set/reset
IC11 IC17 = 45xx:4538: Dual precision monostable MULTIVIBRATOR
IC12 = ssm2164:SSM2164
IC15 IC18 = linear:LM393: COMPARATOR
IC16 = 40xx:4070: Quad 2-input XOR
P1-P11 = resistor:R-TRIMM: Trimm resistor
Q1 = special:XTAL/S: CRYSTAL
R1-R90 = rcl:R-EU_: RESISTOR, European symbol
REF2 = con-lstb:MA04-2: PIN HEADER; OC_FARNELL: unknown; OC_NEWARK: unknown
TP1-TP8 = testpad:TPS: TEST PIN
U/D = pinhead:PINHD-1X2: PIN HEADER
USB = con-berg:PN61729-S: BERG USB connector; OC_FARNELL: unknown; OC_NEWARK: unknown

## Net classes
0 default: width 0.254 mm, drill 0.254 mm, clearance 0.254 mm
1 ground: width 0.508 mm, drill 0.254 mm, clearance 0.254 mm
2 +5V: width 0.381 mm, drill 0.254 mm, clearance 0.254 mm
3 -5V: width 0.381 mm, drill 0.254 mm, clearance 0.254 mm
4 +12V: width 0.381 mm, drill 0.254 mm, clearance 0.254 mm
5 -12V: width 0.381 mm, drill 0.254 mm, clearance 0.254 mm
6 HV115: width 0.381 mm, drill 0.381 mm, clearance 0.508 mm
7 +24V: width 0.381 mm, drill 0.381 mm, clearance 0.254 mm
8 VIN: width 0.381 mm, drill 0.381 mm, clearance 0.254 mm